# Altium schematic sheet TPS54332DDAR.SchDoc
size A
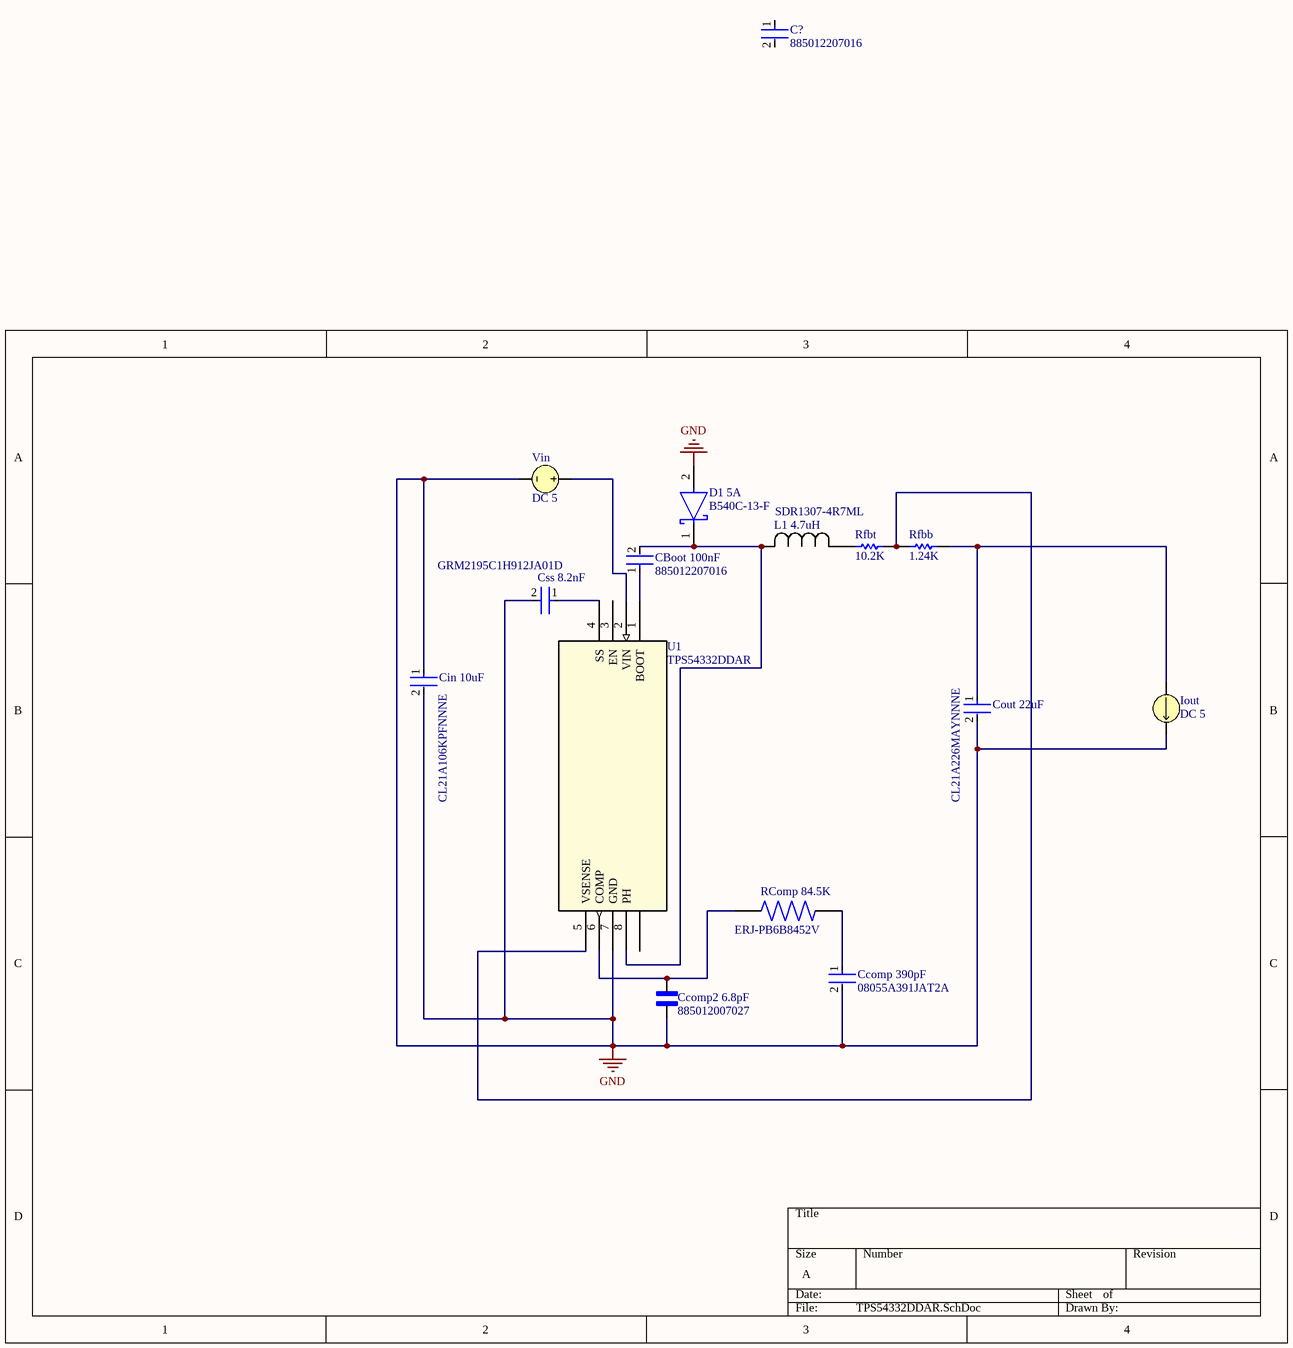
[diagram p0: TPS54332DDAR.SchDoc]

## Parts
C?  885012207016  [FP-885012207016-MFG]
CBoot_100nF  885012207016  [FP-885012207016-MFG]
Ccomp2_6.8pF  885012007027  [WCAP-CSGP_885012007027]
Ccomp_390pF  08055A391JAT2A  [FP-0805-L_2_01_0_2-W_1_25-IPC_C]
Cin_10uF  CL21A106KPFNNNE  [FP-CL21-IPC_B]
Cout_22uF  CL21A226MAYNNNE  [FP-CL21-IPC_C]
Css_8.2nF  GRM2195C1H912JA01D  [FP-GRM219-0_1-MFG]
D1_5A  B540C-13-F  [FP-SMC-MFG]
Iout  DC 5
L1_4.7uH  SDR1307-4R7ML
RComp_84.5K  ERJ-PB6B8452V  [RES_ERJ-PB6B8452V]
Rfbb  value 1.24K  (hidden comment: Resistor)
Rfbt  value 10.2K  (hidden comment: Resistor)
U1  TPS54332DDAR  [DDA8_3X2P13]
Vin  DC 5

## Nets
GND: Ccomp2_6.8pF.1 Ccomp_390pF.2 Cin_10uF.1 Cin_10uF.2 Cout_22uF.2 Css_8.2nF.2 D1_5A.2(A) Iout.2 U1.7(GND) Vin.2
NetCBoot_100nF_1: CBoot_100nF.1 U1.1(BOOT)
NetCBoot_100nF_2: CBoot_100nF.2 D1_5A.1(C) L1_4.7uH.2 U1.8(PH)
NetCcomp2_6.8pF_2: Ccomp2_6.8pF.2 RComp_84.5K.2 U1.6(COMP)
NetCcomp_390pF_1: Ccomp_390pF.1 RComp_84.5K.1
NetCout_22uF_1: Cout_22uF.1 Iout.1 Rfbb.1
NetCss_8.2nF_1: Css_8.2nF.1 U1.4(SS)
NetL1_4.7uH_1: L1_4.7uH.1 Rfbt.2
NetRfbb_2: Rfbb.2 Rfbt.1 U1.5(VSENSE)
NetU1_2: U1.2(VIN) Vin.1

Not connected (* = marked no-connect by the designer): C? 1 2; U1 3(EN) EPAD

## Library data of the parts
C? CBoot_100nF = CMP-207839-000050-1: CAP CER 0.1UF 10V X7R 0805; Capacitance: 100nF; Tolerance: 10%; Min Operating Temperature: -55°C; Series: WCAP-CSGP; Voltage Rating: 10V; Max Operating Temperature: 125°C; Case/Package: 0805; Thickness: 0.035inch; Case Code (Imperial): 0805; Width: 0.049inch; Case Code (Metric): 2012; Mount: Surface Mount; Packaging: Cut Tape; RoHS Compliant: Yes; Length: 0.079inch
Ccomp2_6.8pF = 885012007027: <b> WCAP-CSGP Ceramic Capacitors <br> <br> <br><b>Characteristics </b><br> </b><br>Multilayer Ceramic Chip Capacitor <br>Recommended soldering:Reflow, for 0603 and 0805 wave soldering is also allowed <br>Operating temperature:-55 Â°C to +125 Â°C; <br>Ceramic characteristics: Class I - NPO ; Class II -X7R, X5R <br>High performance ceramic <br>High capacitance stability <br>Minimal aging  <br>Termination:Cu/Ni/Sn <br>   <br><a href="http://katalog.we-online.de/media/images/eisos/WCAP-CSGP_pf2.jpg" title="Enlarge picture"> <img src="http://katalog.we-online.de/media/thumbs2/eisos/thb_WCAP-CSGP_pf2.jpg" width="320"></a><p> Details see: <a href="http://katalog.we-online.de/en/pbs/WCAP-CSGP-0805?">http://katalog.we-online.de/en/pbs/WCAP-CSGP-0805? </a><p>Created:  2015-01-28 <br>2015 (C) Wurth Elektronik; Package: None; Price: None; Value: *; MP: 885012007027; Availability: Unavailable
Ccomp_390pF = CMP-2000-05807-2: General Purpose Ceramic Capacitor, 0805, 390pF, 5%, C0G, 30ppm/°C, 50V; Length: 2.01mm; Depth: 1.25mm; Max Operating Temperature: 125°C; Dielectric: C0G; RoHS Compliant: Yes; REACH SVHC: No SVHC; Voltage: 50V; Tolerance: 5%; Mount: Surface Mount; Thickness: 0.037inch; Contact Plating: Tin; Width: 1.25mm; Dielectric Material: Ceramic; Capacitance: 390pF; Min Operating Temperature: -55°C; Case Code (Metric): 2012; Package Quantity: 1; Lead Free: Lead Free; Voltage Rating: 50V; Height: 0.94mm; Number of Pins: 2; Termination: SMD/SMT; Radiation Hardening: No; Temperature Coefficient: 30ppm/°C; Case/Package: 0805; Packaging: Tape and Reel; Voltage Rating (DC): 50V; Case Code (Imperial): 0805
Cin_10uF = CMP-2000-06103-2: CL21 Series 0805 10uF 10V ±10% Tolerance X5R Multilayer Ceramic Chip Capacitor; Case Code (Imperial): 0805; Capacitance: 10uF; Mount: Surface Mount; Depth: 1.25mm; Length: 2mm; Lead Free: Lead Free; Packaging: Tape and Reel; Dielectric: X5R; Width: 0.049inch; Package Quantity: 1; Height: 1.25mm; Case/Package: 0805; Voltage Rating: 10V; Thickness: 0.053inch; Max Operating Temperature: 85°C; Tolerance: 10%; Case Code (Metric): 2012; Contact Plating: Tin; Min Operating Temperature: -55°C; Radiation Hardening: No; Voltage Rating (DC): 10V
Cout_22uF = CMP-13271-003225-1: CL21 Series 0805 22uF 25V ±20% Tolerance X5R Multilayer Ceramic Chip Capacitor
Css_8.2nF = CMP-2007-00147-2: Chip Multilayer Ceramic Capacitors for General Purpose, 0805, 9100pF, C0G, 30ppm/°C, 5%, 50V; Capacitance: 9.1nF; Voltage: 50V; Length: 2mm; Termination: SMD/SMT; Radiation Hardening: No; Mount: Surface Mount; Thickness: 0.037inch; Case/Package: 0805; Packaging: Tape and Reel; Case Code (Imperial): 0805; Package Quantity: 1; Voltage Rating (DC): 50V; Depth: 1.25mm; Lead Free: Lead Free; Dielectric: C0G; Voltage Rating: 50V; Tolerance: 5%; Height: 0.85mm; Max Operating Temperature: 125°C; Width: 0.049inch; Case Code (Metric): 2012; Min Operating Temperature: -55°C
D1_5A = CMP-2000-05097-3: DIODE SCHOTTKY 40V 5A SMC; Manufacturer: Diodes Inc.; Automotive Grade: NA; Peak Reverse Current: 0.5mA; Value: 300pF; Max Junction Temp: +150°C; Max Surge Forward Current: 100A; Standoff Height: 0.1mm; Digikey Description: DIODE SCHOTTKY 40V 5A SMC; Temperature Range Low: -55°C; Manufacturer Part Number: B540C-13-F; Octopart: https://octopart.com/b540c-13-f-diodes+inc.-325873; Lead Free: Yes; Reverse Voltage: 40V; RoHS: TRUE; Category: Diode; Mouser Description: Diode: Schottky rectifying; SMD; 40V; 5A; SMC; Package: reel, tape; ComponentLink2Description: Datasheet; Temperature Range High: +150°C; Automotive: No; Footprint Url: https://www.diodes.com/assets/Package-Files/SMC.pdf; Device Class L3: Schottky Diodes; Height: 2.5mm; Forward Current: 5A; Temperature: -55°C to +150°C; Package: SMC; ComponentLink2URL: https://www.diodes.com/assets/Datasheets/ds13012.pdf; Device Class L2: Diodes; Max Repetitive Reverse Voltage: 40V; Device Class L1: Discrete Semiconductors; Capacitance: 300pF
Iout = ISRC: Current Source; Note: PCB Footprint - Not required; AC Magnitude: 1; AC Phase: 0; Value: 5; Published: 8-Jun-2000; LatestRevisionDate: 17-Jul-2002; LatestRevisionNote: Re-released for DXP Platform.; PackageReference: Not Applicable; Publisher: Altium Limited
L1_4.7uH = SDR1307-4R7ML: No Description Available; Mfr_Name: Bourns Electronics; Copyright: Copyright (C) 2023 Ultra Librarian. All rights reserved.; Manufacturer_Part_Number: SDR1307-4R7ML; Digi-Key_Part_Number_1: SDR1307-4R7MLCT-ND; Digi-Key_Part_Number_2: SDR1307-4R7MLDKR-ND; Digi-Key_Part_Number_3: SDR1307-4R7MLTR-ND
RComp_84.5K = ERJ-PB6B8452V: MF: {'manufacturer': u'Panasonic'}; MP: ERJ-PB6B8452V; Availability: Unavailable; Package: None; Value: *; Price: None
Rfbb = Resistor: RA73F2A1K24BTD https://www.digikey.com/en/products/detail/te-connectivity-passive-product/RA73F2A1K24BTD/16030904; TC1: 0; SimulationGenericComponent: True; TC2: 0
Rfbt = Resistor: RA73F 2A 10K2 0.1% 5K RL https://www.digikey.com/en/products/detail/te-connectivity-passive-product/RA73F2A10K2BTD/16031520; TC1: 0; SimulationGenericComponent: True; TC2: 0
U1 = TPS54332DDAR: No Description Available; Mfr_Name: Texas Instruments; Copyright: Copyright (C) 2023 Ultra Librarian. All rights reserved.; Manufacturer_Part_Number: TPS54332DDAR; Digi-Key_Part_Number_1: 296-39420-1-ND; Digi-Key_Part_Number_2: 296-39420-2-ND; Digi-Key_Part_Number_3: 296-39420-6-ND; Digi-Key_Part_Number_4: TPS54332DDAR-ND; RefDes: RefDes; Type: Type
Vin = VSRC: Voltage Source; Note: PCB Footprint - Not required; AC Magnitude: 1; AC Phase: 0; Value: 5; Published: 8-Jun-2000; LatestRevisionDate: 17-Jul-2002; LatestRevisionNote: Re-released for DXP Platform.; PackageReference: Not Applicable; Publisher: Altium Limited